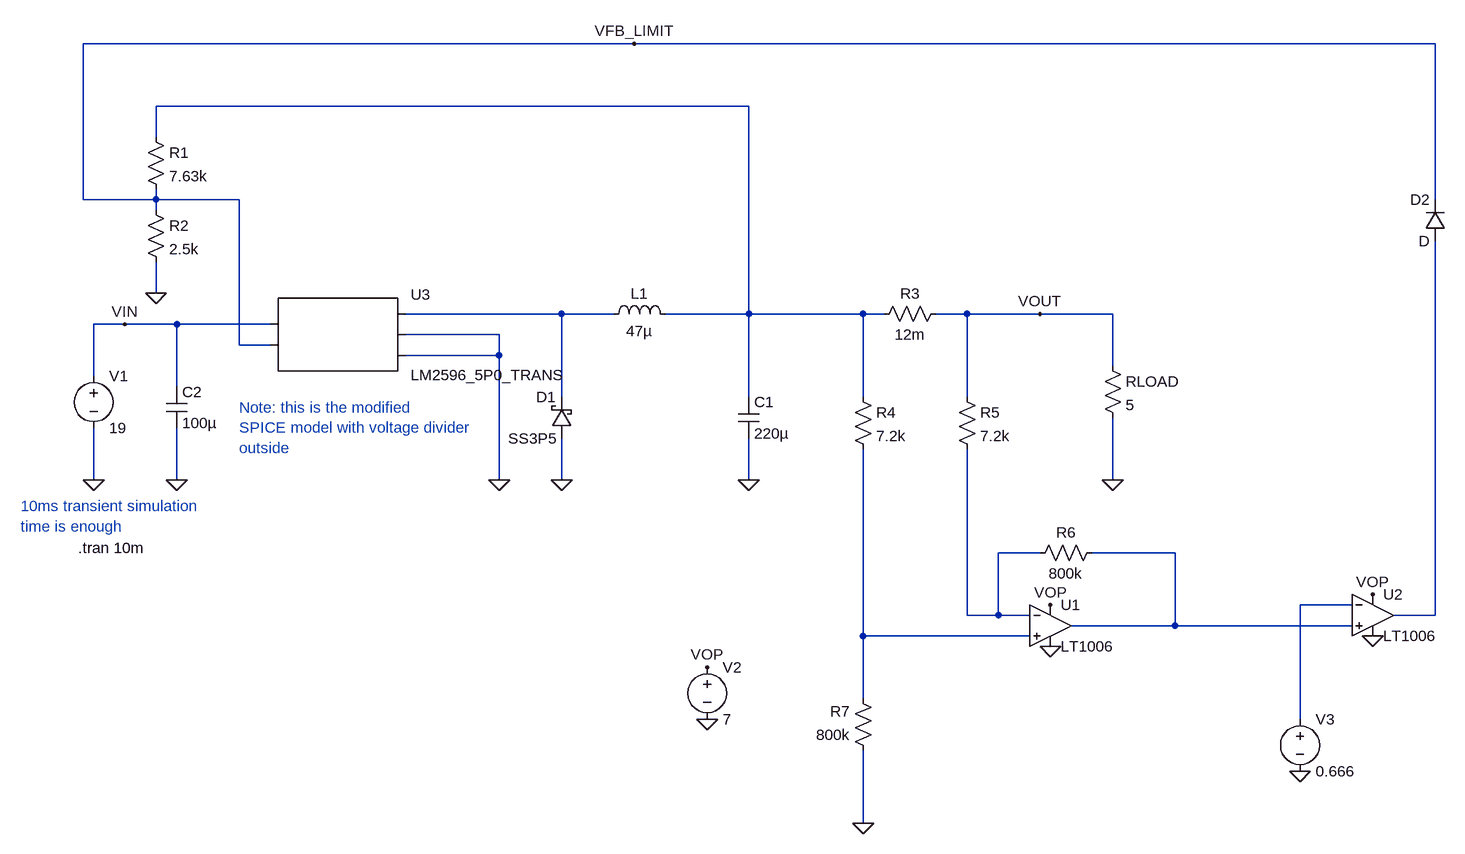
[diagram p0: schematic lm2596-modified-5v-load-5-ohm-transient-10ms-with-current-limiter.asc]
lm2596-modified-5v-load-5-ohm-transient-10ms-with-current-limiter.asc, the LTspice schematic file:
Version 4
SHEET 1 1944 868
WIRE 688 -352 -160 -352
WIRE 1920 -352 688 -352
WIRE 864 -256 -48 -256
WIRE -48 -208 -48 -256
WIRE -160 -112 -160 -352
WIRE -48 -112 -48 -128
WIRE -48 -112 -160 -112
WIRE 80 -112 -48 -112
WIRE 1920 -112 1920 -352
WIRE -48 -96 -48 -112
WIRE -48 32 -48 -16
WIRE 576 64 336 64
WIRE 656 64 576 64
WIRE 864 64 864 -256
WIRE 864 64 736 64
WIRE 1040 64 864 64
WIRE 1072 64 1040 64
WIRE 1200 64 1152 64
WIRE 1312 64 1200 64
WIRE 1424 64 1312 64
WIRE -96 80 -144 80
WIRE -16 80 -96 80
WIRE 128 80 -16 80
WIRE 480 96 336 96
WIRE 80 112 80 -112
WIRE 128 112 80 112
WIRE 480 128 480 96
WIRE 480 128 336 128
WIRE 1424 144 1424 64
WIRE -144 160 -144 80
WIRE -16 176 -16 80
WIRE 576 192 576 64
WIRE 864 192 864 64
WIRE 1040 192 1040 64
WIRE 1200 192 1200 64
WIRE -144 320 -144 240
WIRE -16 320 -16 240
WIRE 480 320 480 128
WIRE 576 320 576 256
WIRE 864 320 864 256
WIRE 1424 320 1424 224
WIRE 1312 432 1248 432
WIRE 1520 432 1392 432
WIRE 1792 512 1712 512
WIRE 1200 528 1200 272
WIRE 1248 528 1248 432
WIRE 1248 528 1200 528
WIRE 1296 528 1248 528
WIRE 1920 528 1920 -48
WIRE 1920 528 1856 528
WIRE 1520 544 1520 432
WIRE 1520 544 1360 544
WIRE 1792 544 1520 544
WIRE 1040 560 1040 272
WIRE 1296 560 1040 560
WIRE 1040 656 1040 560
WIRE 1712 688 1712 512
WIRE 1040 848 1040 736
FLAG -144 320 0
FLAG 480 320 0
FLAG 576 320 0
FLAG 864 320 0
FLAG -16 320 0
FLAG -48 32 0
FLAG 1424 320 0
FLAG -96 80 VIN
FLAG 1312 64 VOUT
FLAG 1328 576 0
FLAG 1040 848 0
FLAG 800 688 0
FLAG 800 608 VOP
FLAG 1328 512 VOP
FLAG 1712 768 0
FLAG 1824 496 VOP
FLAG 1824 560 0
FLAG 688 -352 VFB_LIMIT
SYMBOL cap 848 192 R0
SYMATTR InstName C1
SYMATTR Value 220µ
SYMBOL ind 640 80 R270
WINDOW 0 32 56 VTop 2
WINDOW 3 5 56 VBottom 2
SYMATTR InstName L1
SYMATTR Value 47µ
SYMBOL voltage -144 144 R0
WINDOW 123 0 0 Left 0
WINDOW 39 0 0 Left 0
SYMATTR InstName V1
SYMATTR Value 19
SYMBOL cap -32 176 R0
SYMATTR InstName C2
SYMATTR Value 100µ
SYMBOL schottky 592 256 R180
WINDOW 0 24 64 Left 2
WINDOW 3 24 0 Left 2
SYMATTR InstName D1
SYMATTR Value SS3P5
SYMATTR Description Diode
SYMATTR Type diode
SYMBOL AutoGenerated\\LM2596_5P0_TRANS 224 96 R0
SYMATTR InstName U3
SYMBOL res -64 -224 R0
SYMATTR InstName R1
SYMATTR Value 7.63k
SYMBOL res -64 -112 R0
SYMATTR InstName R2
SYMATTR Value 2.5k
SYMBOL res 1408 128 R0
SYMATTR InstName RLOAD
SYMATTR Value 5
SYMBOL res 1168 48 R90
WINDOW 0 0 56 VBottom 2
WINDOW 3 32 56 VTop 2
SYMATTR InstName R3
SYMATTR Value 12m
SYMBOL res 1024 176 R0
SYMATTR InstName R4
SYMATTR Value 7.2k
SYMBOL res 1184 176 R0
SYMATTR InstName R5
SYMATTR Value 7.2k
SYMBOL res 1408 416 R90
WINDOW 0 0 56 VBottom 2
WINDOW 3 32 56 VTop 2
SYMATTR InstName R6
SYMATTR Value 800k
SYMBOL res 1056 752 R180
WINDOW 0 36 76 Left 2
WINDOW 3 36 40 Left 2
SYMATTR InstName R7
SYMATTR Value 800k
SYMBOL Opamps\\LT1006 1328 480 R0
SYMATTR InstName U1
SYMBOL voltage 800 592 R0
WINDOW 123 0 0 Left 0
WINDOW 39 0 0 Left 0
SYMATTR InstName V2
SYMATTR Value 7
SYMBOL Opamps\\LT1006 1824 464 R0
SYMATTR InstName U2
SYMBOL voltage 1712 672 R0
WINDOW 123 0 0 Left 0
WINDOW 39 0 0 Left 0
SYMATTR InstName V3
SYMATTR Value 0.666
SYMBOL diode 1936 -48 R180
WINDOW 0 24 64 Left 2
WINDOW 3 24 0 Left 2
SYMATTR InstName D2
TEXT -168 424 Left 2 !.tran 10m
TEXT 80 208 Left 2 ;Note: this is the modified\nSPICE model with voltage divider\noutside
TEXT -256 360 Left 2 ;10ms transient simulation \ntime is enough

The netlist it stands for:
* lm2596-modified-5v-load-5-ohm-transient-10ms-with-current-limiter.asc
C1 N001 0 220µ
L1 N002 N001 47µ
V1 VIN 0 19
C2 VIN 0 100µ
D1 0 N002 SS3P5
* U3: LM2596_5P0_TRANS (symbol AutoGenerated\LM2596_5P0_TRANS not available, pins judged from their places): pin1=VIN pin2=VFB_LIMIT pin3=N002 pin4=0 pin5=0
R1 N001 VFB_LIMIT 7.63k
R2 VFB_LIMIT 0 2.5k
RLOAD VOUT 0 5
R3 VOUT N001 12m
R4 N001 N007 7.2k
R5 VOUT N003 7.2k
R6 N004 N003 800k
R7 0 N007 800k
XU1 N007 N003 VOP 0 N004 LT1006  ; pins In+ In- V+ V- OUT
V2 VOP 0 7
XU2 N004 N005 VOP 0 N006 LT1006  ; pins In+ In- V+ V- OUT
V3 N005 0 0.666
D2 N006 VFB_LIMIT D
.model D D
.lib standard.dio
.tran 10m
* Note: this is the modified
* SPICE model with voltage divider
* outside
* 10ms transient simulation
* time is enough
.lib LTC.lib
.backanno
.end